# EAGLE design displayBoard (EAGLE 9.6.1)
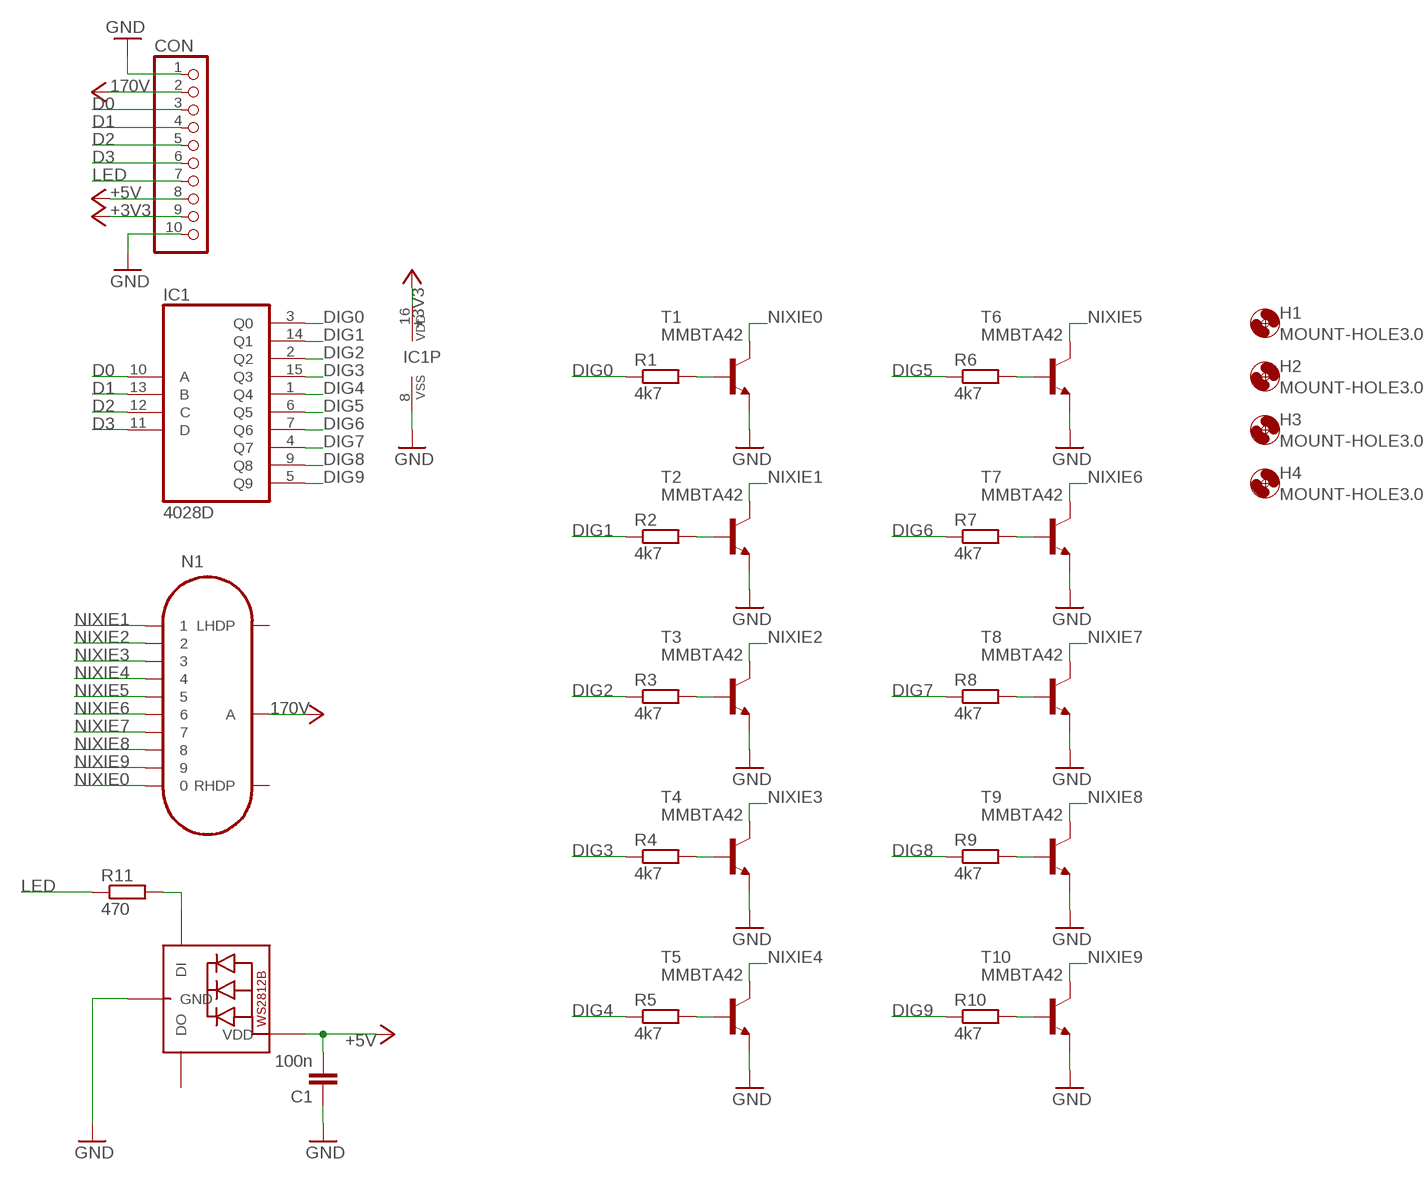
[diagram p0: schematic, sheet 1]

## Parts
C1  100n  C-EUC0603  [C0603]
CON  PINHD-1X10  [1X10]
H1  MOUNT-HOLE3.0  [3,0]
H2  MOUNT-HOLE3.0  [3,0]
H3  MOUNT-HOLE3.0  [3,0]
H4  MOUNT-HOLE3.0  [3,0]
IC1  4028D  [SO16]
LED1  WS2812B_5050N  [WS2812B-NARROW]
N1  IN-14  [IN-14]
R1  4k7  R-EU_R0603  [R0603]
R2  4k7  R-EU_R0603  [R0603]
R3  4k7  R-EU_R0603  [R0603]
R4  4k7  R-EU_R0603  [R0603]
R5  4k7  R-EU_R0603  [R0603]
R6  4k7  R-EU_R0603  [R0603]
R7  4k7  R-EU_R0603  [R0603]
R8  4k7  R-EU_R0603  [R0603]
R9  4k7  R-EU_R0603  [R0603]
R10  4k7  R-EU_R0603  [R0603]
R11  470  R-EU_R0603  [R0603]
T1  MMBTA42  MMBTA42LT1-NPN-SOT23-BEC  [SOT23-BEC]
T2  MMBTA42  MMBTA42LT1-NPN-SOT23-BEC  [SOT23-BEC]
T3  MMBTA42  MMBTA42LT1-NPN-SOT23-BEC  [SOT23-BEC]
T4  MMBTA42  MMBTA42LT1-NPN-SOT23-BEC  [SOT23-BEC]
T5  MMBTA42  MMBTA42LT1-NPN-SOT23-BEC  [SOT23-BEC]
T6  MMBTA42  MMBTA42LT1-NPN-SOT23-BEC  [SOT23-BEC]
T7  MMBTA42  MMBTA42LT1-NPN-SOT23-BEC  [SOT23-BEC]
T8  MMBTA42  MMBTA42LT1-NPN-SOT23-BEC  [SOT23-BEC]
T9  MMBTA42  MMBTA42LT1-NPN-SOT23-BEC  [SOT23-BEC]
T10  MMBTA42  MMBTA42LT1-NPN-SOT23-BEC  [SOT23-BEC]

## Nets
+3V3: CON.9 IC1.16(VDD)
+5V: C1.2 CON.8 LED1.1-VDD(VDD)
D0: CON.3 IC1.10(A)
D1: CON.4 IC1.13(B)
D2: CON.5 IC1.12(C)
D3: CON.6 IC1.11(D)
DIG0: IC1.3(Q0) R1.1
DIG1: IC1.14(Q1) R2.1
DIG2: IC1.2(Q2) R3.1
DIG3: IC1.15(Q3) R4.1
DIG4: IC1.1(Q4) R5.1
DIG5: IC1.6(Q5) R6.1
DIG6: IC1.7(Q6) R7.1
DIG7: IC1.4(Q7) R8.1
DIG8: IC1.9(Q8) R9.1
DIG9: IC1.5(Q9) R10.1
GND: C1.1 CON.1 CON.10 IC1.8(VSS) LED1.3-GND(GND) T1.E T2.E T3.E T4.E T5.E T6.E T7.E T8.E T9.E T10.E
LED: CON.7 R11.1
N$1: R1.2 T1.B
N$2: R2.2 T2.B
N$3: R3.2 T3.B
N$4: R4.2 T4.B
N$5: R5.2 T5.B
N$6: R6.2 T6.B
N$7: R7.2 T7.B
N$8: R8.2 T8.B
N$9: R9.2 T9.B
N$10: R10.2 T10.B
N$11: LED1.4-DIN(DI) R11.2
NIXIE0: N1.0 T1.C
NIXIE1: N1.1 T2.C
NIXIE2: N1.2 T3.C
NIXIE3: N1.3 T4.C
NIXIE4: N1.4 T5.C
NIXIE5: N1.5 T6.C
NIXIE6: N1.6 T7.C
NIXIE7: N1.7 T8.C
NIXIE8: N1.8 T9.C
NIXIE9: N1.9 T10.C
VCC: CON.2 N1.A ; supply symbol labelled 170V
Unconnected: LED1.2-DOUT(DO) N1.LHDP N1.RHDP

## Library data of the parts
C1 = resistor:C-EU: CAPACITOR, European symbol
CON = pinhead:PINHD-1X10: PIN HEADER
H1-H4 = holes:MOUNT-HOLE: MOUNTING HOLE with drill center marker
IC1 = 40xx:4028: BCD to decimal DECODER
LED1 = adafruit:WS2812B
N1 = russian-nixies:IN-14: IN-14: medium numeric frontview nixie tube
R1-R11 = resistor:R-EU_: RESISTOR, European symbol
T1-T10 = transistor:*-NPN-: NPN Transistror BF959 corrected 2008.03.06

## Board
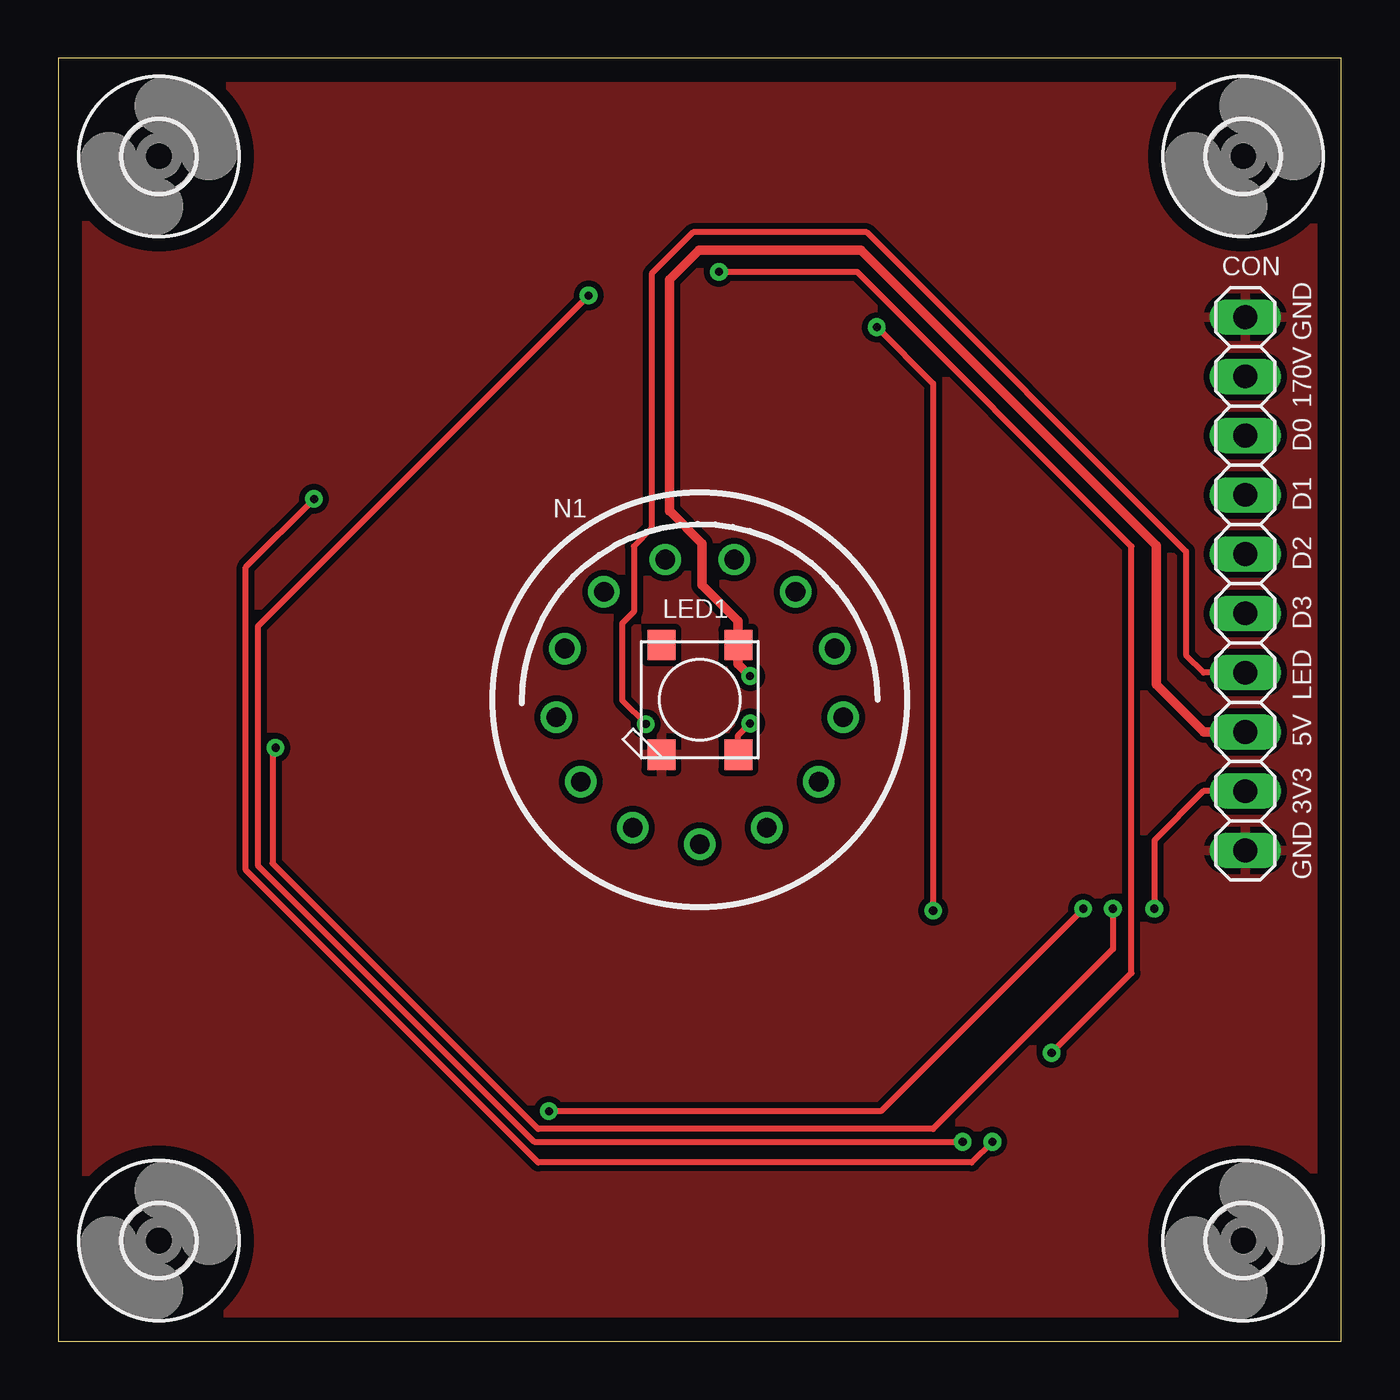
[diagram p1: board, top side]
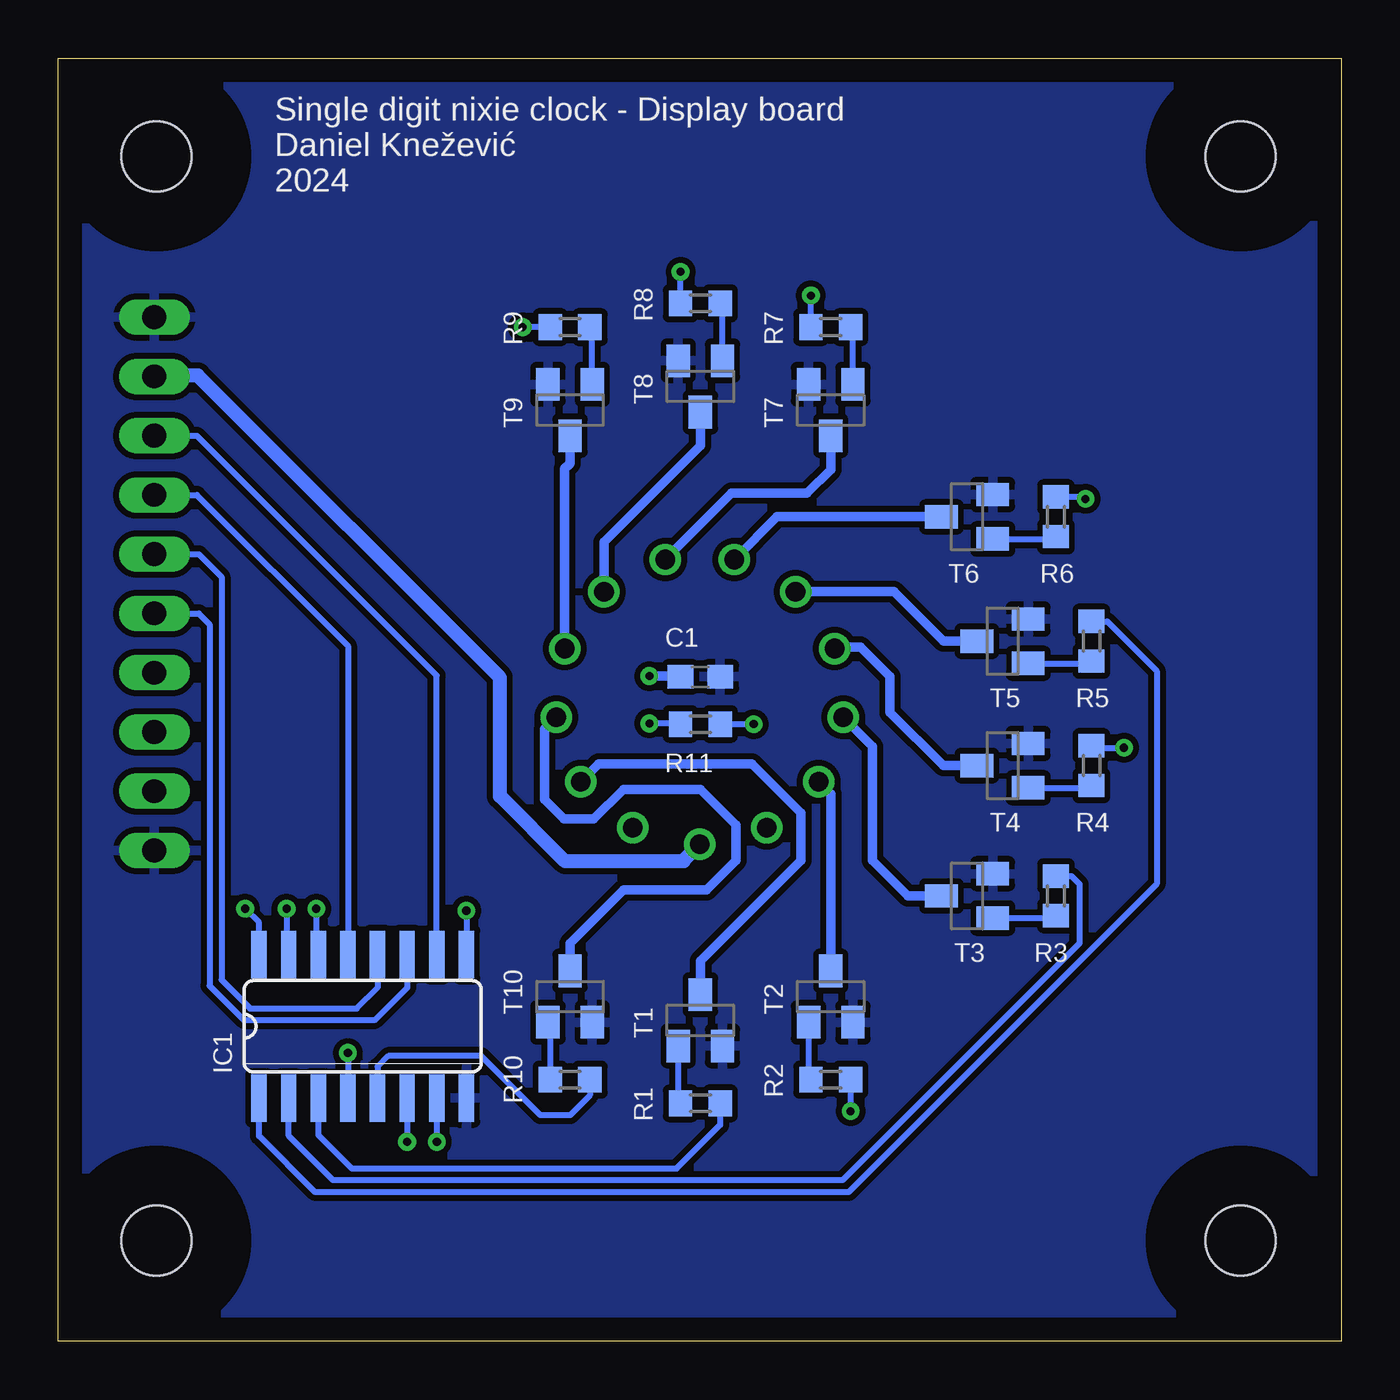
[diagram p2: board, bottom side, seen from below]

Size 55 x 55 mm. Coordinates in mm from the lower left corner, seen from the top.
Outline: 0,0 55,0 55,55 0,55 0,0
Copper layers (1*16): Top 0.035mm / dielectric 1.5mm / Bottom 0.035mm
Design rules "default *": minimum track width 6mil, minimum drill 0.35mm, track to track 10mil, track to pad 6mil, pad to pad 6mil, via to via 6mil, smd to smd 6mil, copper to edge 40mil, drill to drill 6mil, minimum pad ring 10mil, minimum via ring 8mil, stop-mask expansion 4mil, vias tented up to drill 0mil, thermal gap 10mil

### Footprints (pad centres in the part's own frame; a part is rotated, then mirrored left to right if it is on the bottom)
C0603 = smd 1.1 x 1: 1 -0.85,0; 2 0.85,0
1X10 = drill 1.016 long: 1 -11.43,0; 2 -8.89,0; 3 -6.35,0; 4 -3.81,0; 5 -1.27,0; 6 1.27,0; 7 3.81,0; 8 6.35,0; 9 8.89,0; 10 11.43,0
3,0 = hole 3: 0,0
SO16 = smd 0.66 x 2.032: 1 -4.445,-3.073; 2 -3.175,-3.073; 3 -1.905,-3.073; 4 -0.635,-3.073; 5 0.635,-3.073; 6 1.905,-3.073; 7 3.175,-3.073; 8 4.445,-3.073; 9 4.445,3.073; 10 3.175,3.073; 11 1.905,3.073; 12 0.635,3.073; 13 -0.635,3.073; 14 -1.905,3.073; 15 -3.175,3.073; 16 -4.445,3.073
WS2812B-NARROW = smd 1.3 x 1.2: 1-VDD 2.35,-1.65; 2-DOUT 2.35,1.65; 3-GND -2.35,1.65; 4-DIN -2.35,-1.65
IN-14 = drill 0.84: 0 5.094,-3.516; 1 -5.094,-3.516; 2 -6.145,-0.746; 3 -5.788,2.195; 4 -4.105,4.633; 5 -1.481,6.01; 6 1.481,6.01; 7 4.105,4.633; 8 5.788,2.195; 9 6.145,-0.746; A 0,-6.19; LHDP 2.877,-5.481; RHDP -2.877,-5.481
R0603 = smd 1 x 1.1: 1 -0.85,0; 2 0.85,0
SOT23-BEC = smd 1 x 1.4: B -0.95,-1.1; C 0,1.1; E 0.95,-1.1

### Placement (x,y rotation side)
C1  27.47,28.49 180 bottom
CON  50.89,32.47 270 top
H1  50.8,50.8 0 top
H2  4.32,50.8 0 top
H3  4.32,4.32 0 top
H4  50.8,4.32 0 top
IC1  41.95,13.5 0 bottom
LED1  27.5,27.5 90 top
N1  27.5,27.5 0 top
R1  27.47,10.2 180 bottom
R2  21.88,11.22 180 bottom
R3  12.23,19.09 270 bottom
R4  10.71,24.68 270 bottom
R5  10.71,30.01 270 bottom
R6  12.23,35.35 270 bottom
R7  21.88,43.47 0 bottom
R8  27.47,44.49 0 bottom
R9  33.06,43.47 0 bottom
R10  33.06,11.22 180 bottom
R11  27.47,26.46 180 bottom
T1  27.47,13.76 0 bottom
T2  21.88,14.77 0 bottom
T3  16.04,19.09 90 bottom
T4  14.52,24.68 90 bottom
T5  14.52,30.01 90 bottom
T6  16.04,35.35 90 bottom
T7  21.88,39.92 180 bottom
T8  27.47,40.93 180 bottom
T9  33.06,39.92 180 bottom
T10  33.06,14.77 0 bottom

### Tracks (layer width: path | path; a pad name or v marks a point on that pad's centre or on a via)
+3V3  (via drill 0.35)
  Top 0.254: CON.9 49.09,23.58 46.99,21.48 v46.99,18.54
  Bottom 0.254: IC1.16 46.4,17.95 v46.99,18.54
+5V  (via drill 0.35)
  Top 0.406: v29.66,28.52 29.15,29.02 LED1.1-VDD 29.15,30.87 27.6,32.42 27.6,34.2 26.2,35.6 26.2,45.51 27.47,46.78 34.41,46.78 47.08,34.11 47.08,28.15 49.11,26.12 CON.8
  Bottom 0.406: C1.2 28.35,28.52 v29.66,28.52
D0
  Bottom 0.254: CON.3 49.06,38.82 38.77,28.54 IC1.10
D1
  Bottom 0.254: CON.4 49.06,36.28 42.59,29.8 IC1.13
D2
  Bottom 0.254: IC1.12 41.31,15.15 42.2,14.26 46.78,14.26 48.01,15.49 48.01,32.77 48.98,33.74 CON.5
D3
  Bottom 0.254: IC1.11 40.05,15.15 41.44,13.76 47.03,13.76 48.51,15.24 48.51,30.73 48.98,31.2 CON.6
DIG0
  Bottom 0.254: R1.1 26.62,9.27 28.49,7.41 42.42,7.41 43.85,8.84 IC1.3
DIG1  (via drill 0.35)
  Top 0.254: v21.03,9.86 35.26,9.86 v43.94,18.54
  Bottom 0.254: R2.1 v21.03,9.86 | v43.94,18.54 43.94,16.66 IC1.14
DIG2
  Bottom 0.254: R3.1 11.56,19.94 11.22,19.6 11.22,17.06 21.38,6.9 43.22,6.9 45.12,8.8 IC1.2
DIG3  (via drill 0.35)
  Top 0.254: v9.31,25.44 9.18,25.31 9.18,20.49 20.57,9.1 37.5,9.1 45.21,16.81 v45.21,18.54
  Bottom 0.254: R4.1 10.62,25.44 v9.31,25.44 | v45.21,18.54 45.21,16.66 IC1.15
DIG4
  Bottom 0.254: R5.1 10.03,30.86 7.91,28.74 7.91,19.6 21.12,6.39 43.98,6.39 46.4,8.8 IC1.1
DIG5  (via drill 0.35)
  Top 0.254: v40.05,8.55 39.16,7.66 20.57,7.66 8.04,20.19 8.04,33.19 v10.96,36.11
  Bottom 0.254: IC1.6 v40.05,8.55 | v10.96,36.11 11.05,36.2 R6.1
DIG6  (via drill 0.35)
  Top 0.254: v22.73,44.83 8.55,30.65 8.55,20.4 20.4,8.55 v38.77,8.55
  Bottom 0.254: R7.1 v22.73,44.83 | IC1.7 v38.77,8.55
DIG7  (via drill 0.35)
  Top 0.254: v28.32,45.85 34.24,45.85 46.01,34.08 46.01,15.79 v42.59,12.36
  Bottom 0.254: R8.1 v28.32,45.85 | v42.59,12.36 IC1.4
DIG8  (via drill 0.35)
  Top 0.254: v35.09,43.47 37.51,41.06 v37.51,18.45
  Bottom 0.254: R9.1 v35.09,43.47 | v37.51,18.45 IC1.9
DIG9
  Bottom 0.254: R10.1 32.21,10.54 33.06,9.69 34.33,9.69 36.87,12.23 40.85,12.23 41.31,11.77 IC1.5
GND
  pour Bottom: 0,55.2 55.2,55.2 55.2,0 0,0
  pour Top: 0,55.23 55.23,55.23 55.23,0 0,0
LED  (via drill 0.35)
  Top 0.254: CON.7 49.11,28.66 48.35,29.42 48.35,33.85 34.66,47.54 27.22,47.54 25.44,45.76 25.44,34.84 24.68,34.08 24.68,31.28 24.17,30.77 24.17,27.47 v25.19,26.46
  Bottom 0.254: R11.1 v25.19,26.46
N$1
  Bottom 0.254: T1.B 28.42,10.3 R1.2
N$2
  Bottom 0.254: T2.B 22.83,11.32 R2.2
N$3
  Bottom 0.254: T3.B 12.33,18.14 R3.2
N$4
  Bottom 0.254: T4.B 10.81,23.73 R4.2
N$5
  Bottom 0.254: T5.B 10.81,29.06 R5.2
N$6
  Bottom 0.254: T6.B 12.33,34.4 R6.2
N$7
  Bottom 0.254: T7.B 20.93,43.37 R7.2
N$8
  Bottom 0.254: T8.B 26.52,44.39 R8.2
N$9
  Bottom 0.254: T9.B 32.11,43.37 R9.2
N$10
  Bottom 0.254: T10.B 33.91,13.57 R10.2
N$11  (via drill 0.35)
  Top 0.254: LED1.4-DIN 29.15,25.98 v29.66,26.48
  Bottom 0.254: 28.35,26.48 v29.66,26.48
  Bottom 0.406: R11.2 28.35,26.48
NIXIE0
  Bottom 0.406: T1.C 27.47,16.3 23.15,20.61 23.15,22.65 25.25,24.75 31.83,24.75 N1.0
NIXIE1
  Bottom 0.406: N1.1 21.88,23.46 T2.C
NIXIE2
  Bottom 0.254: N1.2 21.31,26.71
  Bottom 0.406: T3.C 18.58,19.09 20.11,20.61 20.11,25.5 21.31,26.71
NIXIE3
  Bottom 0.406: T4.C 17.06,24.68 19.34,26.96 19.34,28.49 20.61,29.76 21.65,29.76 N1.3
NIXIE4
  Bottom 0.406: T5.C 17.06,30.01 19.18,32.13 N1.4
NIXIE5
  Bottom 0.406: T6.C 24.18,35.35 N1.5
NIXIE6
  Bottom 0.406: T7.C 21.88,37.38 22.9,36.36 26.13,36.36 N1.6
NIXIE7
  Bottom 0.406: T8.C 27.47,38.39 31.61,34.26 N1.7
NIXIE8
  Bottom 0.406: N1.8 33.29,37.4 33.06,37.63 T9.C
NIXIE9
  Bottom 0.406: T10.C 33.06,17.06 30.77,19.34 27.22,19.34 25.95,20.61 25.95,22.14 27.47,23.66 30.77,23.66 32.04,22.39 33.31,22.39 34.15,23.23 34.15,26.25 N1.9
VCC
  Bottom 0.61: CON.2 50.33,41.36 50.29,41.4 49.02,41.4 36.07,28.45 36.07,23.37 33.27,20.57 28.19,20.57 28.19,20.62 N1.A

### Text on the board
tNames: GND | 170V | D0 | D1 | D2 | D3 | LED | 5V | 3V3 | GND
bNames: Single digit nixie clock - Display board / Daniel Knežević / 2024